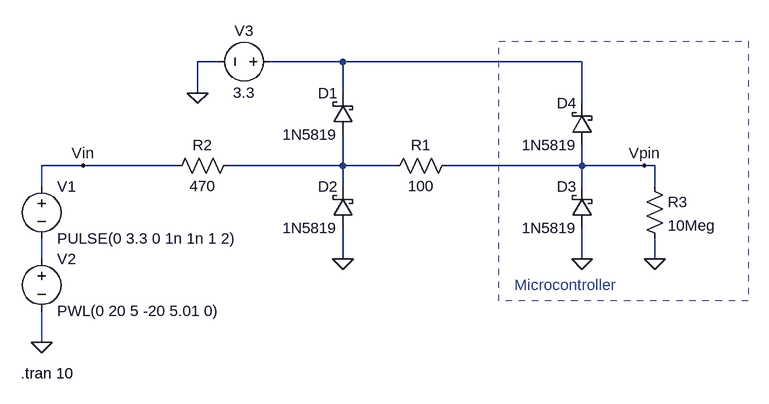
[diagram p0: schematic Digital Input Protection.asc]
Digital Input Protection.asc, the LTspice schematic file:
Version 4
SHEET 1 880 680
WIRE 48 -16 16 -16
WIRE 240 -16 128 -16
WIRE 608 -16 240 -16
WIRE 16 32 16 -16
WIRE 240 32 240 -16
WIRE 608 48 608 -16
WIRE -160 144 -224 144
WIRE -16 144 -160 144
WIRE 240 144 240 96
WIRE 240 144 64 144
WIRE 320 144 240 144
WIRE 608 144 608 112
WIRE 608 144 400 144
WIRE 704 144 608 144
WIRE 720 144 704 144
WIRE -224 176 -224 144
WIRE 240 176 240 144
WIRE 608 176 608 144
WIRE 720 176 720 144
WIRE -224 288 -224 256
WIRE 240 288 240 240
WIRE 608 288 608 240
WIRE 720 288 720 256
WIRE -224 416 -224 368
FLAG 720 288 0
FLAG -224 416 0
FLAG 608 288 0
FLAG 240 288 0
FLAG 16 32 0
FLAG 704 144 Vpin
FLAG -160 144 Vin
SYMBOL schottky 256 96 R180
WINDOW 0 24 64 Left 2
WINDOW 3 24 0 Left 2
SYMATTR InstName D1
SYMATTR Value 1N5819
SYMATTR Description Diode
SYMATTR Type diode
SYMBOL res 416 128 R90
WINDOW 0 0 56 VBottom 2
WINDOW 3 32 56 VTop 2
SYMATTR InstName R1
SYMATTR Value 100
SYMBOL res 80 128 R90
WINDOW 0 0 56 VBottom 2
WINDOW 3 32 56 VTop 2
SYMATTR InstName R2
SYMATTR Value 470
SYMBOL res 704 160 R0
SYMATTR InstName R3
SYMATTR Value 10Meg
SYMBOL voltage -224 160 R0
WINDOW 123 0 0 Left 0
WINDOW 39 0 0 Left 0
SYMATTR InstName V1
SYMATTR Value PULSE(0 3.3 0 1n 1n 1 2)
SYMBOL voltage -224 272 R0
WINDOW 123 0 0 Left 0
WINDOW 39 0 0 Left 0
SYMATTR InstName V2
SYMATTR Value PWL(0 20 5 -20 5.01 0)
SYMBOL voltage 144 -16 R90
WINDOW 0 -32 56 VBottom 2
WINDOW 3 32 56 VTop 2
WINDOW 123 0 0 Left 0
WINDOW 39 0 0 Left 0
SYMATTR InstName V3
SYMATTR Value 3.3
SYMBOL schottky 256 240 R180
WINDOW 0 24 64 Left 2
WINDOW 3 24 0 Left 2
SYMATTR InstName D2
SYMATTR Value 1N5819
SYMATTR Description Diode
SYMATTR Type diode
SYMBOL schottky 624 240 R180
WINDOW 0 24 64 Left 2
WINDOW 3 24 0 Left 2
SYMATTR InstName D3
SYMATTR Value 1N5819
SYMATTR Description Diode
SYMATTR Type diode
SYMBOL schottky 624 112 R180
WINDOW 0 24 64 Left 2
WINDOW 3 24 0 Left 2
SYMATTR InstName D4
SYMATTR Value 1N5819
SYMATTR Description Diode
SYMATTR Type diode
TEXT -256 464 Left 2 !.tran 10
TEXT 504 328 Left 2 ;Microcontroller
RECTANGLE Normal 864 352 480 -48 2

The netlist it stands for:
* Digital Input Protection.asc
D1 N002 N001 1N5819
R1 Vpin N002 100
R2 N002 Vin 470
R3 Vpin 0 10Meg
V1 Vin N003 PULSE(0 3.3 0 1n 1n 1 2)
V2 N003 0 PWL(0 20 5 -20 5.01 0)
V3 N001 0 3.3
D2 0 N002 1N5819
D3 0 Vpin 1N5819
D4 Vpin N001 1N5819
.model D D
.lib standard.dio
.tran 10
* Microcontroller
.backanno
.end